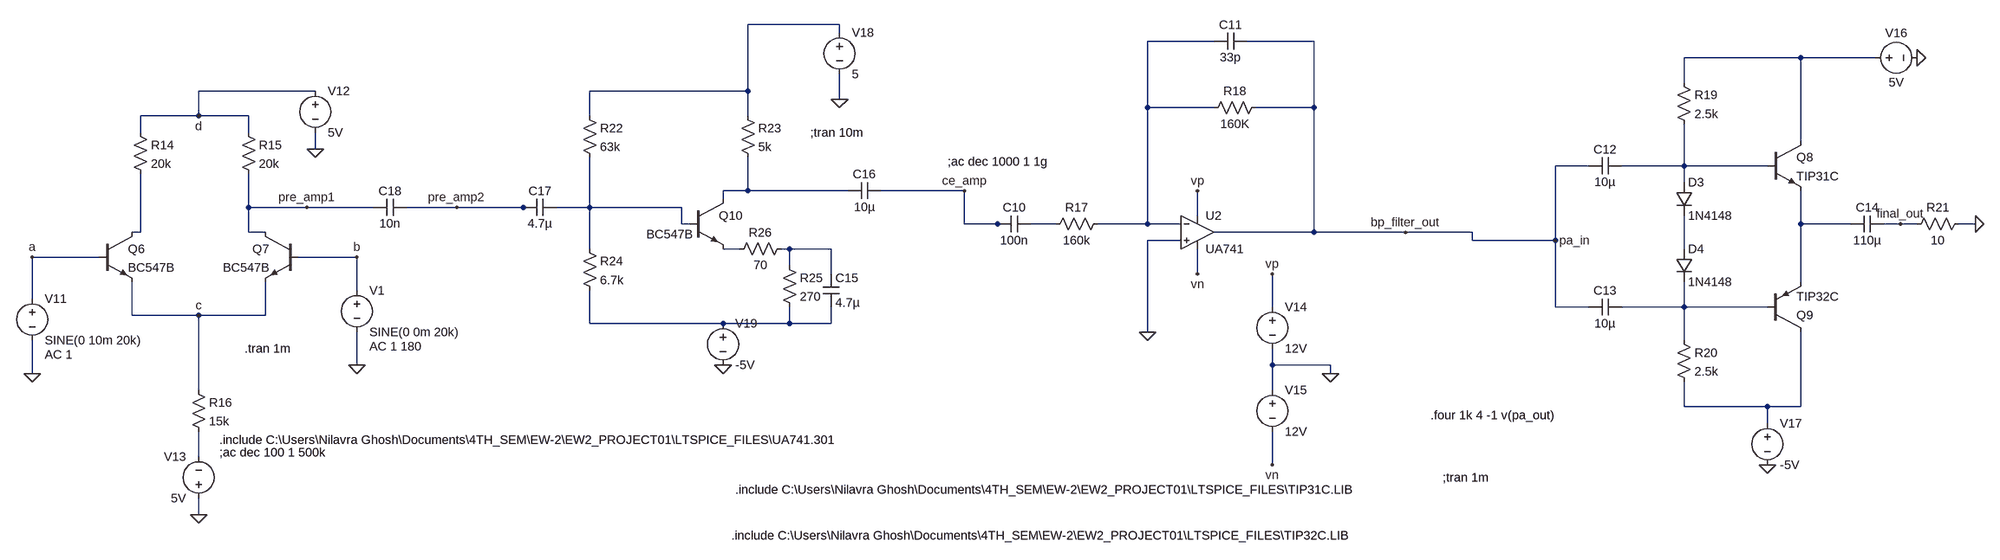
[diagram p0: schematic check_combined.asc]
check_combined.asc, the LTspice schematic file:
Version 4
SHEET 1 4244 2864
WIRE 1504 1440 1328 1440
WIRE 1504 1456 1504 1440
WIRE 2224 1472 2096 1472
WIRE 2416 1472 2288 1472
WIRE 3360 1504 3136 1504
WIRE 3504 1504 3360 1504
WIRE 3136 1552 3136 1504
WIRE 496 1568 272 1568
WIRE 1328 1568 1328 1440
WIRE 1328 1568 1024 1568
WIRE 1504 1584 1504 1536
WIRE 2096 1600 2096 1472
WIRE 2224 1600 2096 1600
WIRE 2416 1600 2416 1472
WIRE 2416 1600 2304 1600
WIRE 272 1616 272 1568
WIRE 272 1616 160 1616
WIRE 368 1616 272 1616
WIRE 1024 1616 1024 1568
WIRE 1328 1616 1328 1568
WIRE 160 1648 160 1616
WIRE 368 1648 368 1616
WIRE 3360 1664 3360 1504
WIRE 496 1680 496 1648
WIRE 2944 1712 2880 1712
WIRE 3136 1712 3136 1632
WIRE 3136 1712 3008 1712
WIRE 3296 1712 3136 1712
WIRE 3136 1744 3136 1712
WIRE 1328 1760 1328 1696
WIRE 1328 1760 1280 1760
WIRE 1520 1760 1328 1760
WIRE 1744 1760 1584 1760
WIRE 1280 1776 1280 1760
WIRE 368 1792 368 1728
WIRE 480 1792 368 1792
WIRE 608 1792 480 1792
WIRE 768 1792 672 1792
WIRE 896 1792 768 1792
WIRE 912 1792 896 1792
WIRE 1024 1792 1024 1696
WIRE 1024 1792 960 1792
WIRE 1200 1792 1024 1792
WIRE 2192 1808 2192 1760
WIRE 1200 1824 1200 1792
WIRE 1216 1824 1200 1824
WIRE 1744 1824 1744 1760
WIRE 1808 1824 1744 1824
WIRE 1824 1824 1808 1824
WIRE 1920 1824 1872 1824
WIRE 2096 1824 2096 1600
WIRE 2096 1824 2000 1824
WIRE 2160 1824 2096 1824
WIRE 3360 1824 3360 1760
WIRE 3456 1824 3360 1824
WIRE 3552 1824 3520 1824
WIRE 3584 1824 3552 1824
WIRE 3696 1824 3664 1824
WIRE 160 1840 160 1728
WIRE 160 1840 144 1840
WIRE 368 1840 368 1792
WIRE 400 1840 368 1840
WIRE 2416 1840 2416 1600
WIRE 2416 1840 2224 1840
WIRE 2592 1840 2416 1840
WIRE 2720 1840 2592 1840
WIRE 2160 1856 2096 1856
WIRE 2720 1856 2720 1840
WIRE 2880 1856 2880 1712
WIRE 2880 1856 2720 1856
WIRE 1024 1872 1024 1792
WIRE 1312 1872 1280 1872
WIRE 1408 1872 1392 1872
WIRE 1488 1872 1408 1872
WIRE 3136 1872 3136 1808
WIRE 80 1888 -48 1888
WIRE 576 1888 464 1888
WIRE 1408 1904 1408 1872
WIRE 1488 1920 1488 1872
WIRE 2192 1920 2192 1872
WIRE 3360 1936 3360 1824
WIRE 576 1952 576 1888
WIRE -48 1968 -48 1888
WIRE 2336 1984 2336 1920
WIRE 2880 1984 2880 1856
WIRE 2944 1984 2880 1984
WIRE 3136 1984 3136 1936
WIRE 3136 1984 3008 1984
WIRE 3296 1984 3136 1984
WIRE 144 2000 144 1936
WIRE 272 2000 144 2000
WIRE 400 2000 400 1936
WIRE 400 2000 272 2000
WIRE 1024 2016 1024 1952
WIRE 1280 2016 1024 2016
WIRE 1408 2016 1408 1984
WIRE 1408 2016 1280 2016
WIRE 1488 2016 1488 1984
WIRE 1488 2016 1408 2016
WIRE 2096 2032 2096 1856
WIRE 3136 2048 3136 1984
WIRE 576 2096 576 2032
WIRE 2336 2096 2336 2064
WIRE 2448 2096 2336 2096
WIRE -48 2112 -48 2048
WIRE 2448 2112 2448 2096
WIRE 272 2144 272 2000
WIRE 2336 2144 2336 2096
WIRE 3136 2176 3136 2128
WIRE 3296 2176 3136 2176
WIRE 3360 2176 3360 2032
WIRE 3360 2176 3296 2176
WIRE 3296 2208 3296 2176
WIRE 272 2272 272 2224
WIRE 2336 2288 2336 2224
WIRE 272 2384 272 2352
FLAG -48 2112 0
FLAG 496 1680 0
FLAG 272 2384 0
FLAG -48 1888 a
FLAG 576 1888 b
FLAG 272 2000 c
FLAG 272 1616 d
FLAG 2448 2112 0
FLAG 2336 1920 vp
FLAG 2336 2288 vn
FLAG 2192 1760 vp
FLAG 2192 1920 vn
FLAG 2096 2032 0
FLAG 3696 1824 0
FLAG 3584 1504 0
FLAG 3296 2288 0
FLAG 2880 1856 pa_in
FLAG 3552 1824 final_out
FLAG 1504 1584 0
FLAG 1280 2096 0
FLAG 576 2096 0
FLAG 768 1792 pre_amp2
FLAG 480 1792 pre_amp1
FLAG 1744 1760 ce_amp
FLAG 2592 1840 bp_filter_out
SYMBOL voltage -48 1952 R0
WINDOW 123 24 124 Left 2
WINDOW 39 0 0 Left 0
SYMATTR Value2 AC 1
SYMATTR InstName V11
SYMATTR Value SINE(0 10m 20k)
SYMBOL res 144 1632 R0
SYMATTR InstName R14
SYMATTR Value 20k
SYMBOL res 352 1632 R0
SYMATTR InstName R15
SYMATTR Value 20k
SYMBOL res 256 2128 R0
SYMATTR InstName R16
SYMATTR Value 15k
SYMBOL npn 80 1840 R0
SYMATTR InstName Q6
SYMATTR Value BC547B
SYMBOL npn 464 1840 M0
SYMATTR InstName Q7
SYMATTR Value BC547B
SYMBOL voltage 496 1552 R0
WINDOW 123 0 0 Left 0
WINDOW 39 0 0 Left 0
SYMATTR InstName V12
SYMATTR Value 5V
SYMBOL voltage 272 2368 R180
WINDOW 0 24 96 Left 2
WINDOW 3 24 16 Left 2
WINDOW 123 0 0 Left 0
WINDOW 39 0 0 Left 0
SYMATTR InstName V13
SYMATTR Value 5V
SYMBOL OpAmps\\opamp2 2192 1776 R0
SYMATTR InstName U2
SYMATTR Value UA741
SYMBOL voltage 2336 1968 R0
WINDOW 123 0 0 Left 0
WINDOW 39 0 0 Left 0
SYMATTR InstName V14
SYMATTR Value 12V
SYMBOL voltage 2336 2128 R0
WINDOW 123 0 0 Left 0
WINDOW 39 0 0 Left 0
SYMATTR InstName V15
SYMATTR Value 12V
SYMBOL res 2016 1808 R90
WINDOW 0 0 56 VBottom 2
WINDOW 3 32 56 VTop 2
SYMATTR InstName R17
SYMATTR Value 160k
SYMBOL cap 1872 1808 R90
WINDOW 0 0 32 VBottom 2
WINDOW 3 32 32 VTop 2
SYMATTR InstName C10
SYMATTR Value 100n
SYMBOL res 2320 1584 R90
WINDOW 0 0 56 VBottom 2
WINDOW 3 32 56 VTop 2
SYMATTR InstName R18
SYMATTR Value 160K
SYMBOL cap 2288 1456 R90
WINDOW 0 0 32 VBottom 2
WINDOW 3 32 32 VTop 2
SYMATTR InstName C11
SYMATTR Value 33p
SYMBOL cap 3008 1696 R90
WINDOW 0 0 32 VBottom 2
WINDOW 3 32 32 VTop 2
SYMATTR InstName C12
SYMATTR Value 10µ
SYMBOL cap 3008 1968 R90
WINDOW 0 0 32 VBottom 2
WINDOW 3 32 32 VTop 2
SYMATTR InstName C13
SYMATTR Value 10µ
SYMBOL res 3120 1536 R0
SYMATTR InstName R19
SYMATTR Value 2.5k
SYMBOL res 3120 2032 R0
SYMATTR InstName R20
SYMATTR Value 2.5k
SYMBOL npn 3296 1664 R0
SYMATTR InstName Q8
SYMATTR Value TIP31C
SYMBOL pnp 3296 2032 M180
SYMATTR InstName Q9
SYMATTR Value TIP32C
SYMBOL diode 3120 1744 R0
SYMATTR InstName D3
SYMATTR Value 1N4148
SYMBOL diode 3120 1872 R0
SYMATTR InstName D4
SYMATTR Value 1N4148
SYMBOL voltage 3488 1504 R270
WINDOW 0 32 56 VTop 2
WINDOW 3 -32 56 VBottom 2
WINDOW 123 0 0 Left 0
WINDOW 39 0 0 Left 0
SYMATTR InstName V16
SYMATTR Value 5V
SYMBOL res 3680 1808 R90
WINDOW 0 0 56 VBottom 2
WINDOW 3 32 56 VTop 2
SYMATTR InstName R21
SYMATTR Value 10
SYMBOL voltage 3296 2192 R0
WINDOW 123 0 0 Left 0
WINDOW 39 0 0 Left 0
SYMATTR InstName V17
SYMATTR Value -5V
SYMBOL cap 3520 1808 R90
WINDOW 0 0 32 VBottom 2
WINDOW 3 32 32 VTop 2
SYMATTR InstName C14
SYMATTR Value 110µ
SYMBOL res 1008 1600 R0
SYMATTR InstName R22
SYMATTR Value 63k
SYMBOL res 1312 1600 R0
SYMATTR InstName R23
SYMATTR Value 5k
SYMBOL cap 1472 1920 R0
SYMATTR InstName C15
SYMATTR Value 4.7µ
SYMBOL res 1008 1856 R0
SYMATTR InstName R24
SYMATTR Value 6.7k
SYMBOL npn 1216 1776 R0
WINDOW 3 -83 68 Left 2
SYMATTR Value BC547B
SYMATTR InstName Q10
SYMBOL res 1392 1888 R0
SYMATTR InstName R25
SYMATTR Value 270
SYMBOL res 1408 1856 R90
WINDOW 0 0 56 VBottom 2
WINDOW 3 32 56 VTop 2
SYMATTR InstName R26
SYMATTR Value 70
SYMBOL voltage 1504 1440 R0
WINDOW 123 0 0 Left 0
WINDOW 39 0 0 Left 0
SYMATTR InstName V18
SYMATTR Value 5
SYMBOL cap 1584 1744 R90
WINDOW 0 0 32 VBottom 2
WINDOW 3 32 32 VTop 2
SYMATTR InstName C16
SYMATTR Value 10µ
SYMBOL cap 960 1776 R90
WINDOW 0 0 32 VBottom 2
WINDOW 3 32 32 VTop 2
SYMATTR InstName C17
SYMATTR Value 4.7µ
SYMBOL voltage 1280 2000 R0
WINDOW 123 0 0 Left 0
WINDOW 39 0 0 Left 0
SYMATTR InstName V19
SYMATTR Value -5V
SYMBOL cap 672 1776 R90
WINDOW 0 0 32 VBottom 2
WINDOW 3 32 32 VTop 2
SYMATTR InstName C18
SYMATTR Value 10n
SYMBOL voltage 576 1936 R0
WINDOW 123 24 124 Left 2
WINDOW 39 0 0 Left 0
SYMATTR Value2 AC 1 180
SYMATTR InstName V1
SYMATTR Value SINE(0 0m 20k)
TEXT 360 2064 Left 2 !.tran 1m
TEXT 2664 2312 Left 2 !;tran 1m
TEXT 1448 1648 Left 2 !;tran 10m
TEXT 1712 1704 Left 2 !;ac dec 1000 1 1g
TEXT 2640 2192 Left 2 !.four 1k 4 -1 v(pa_out)
TEXT 312 2240 Left 2 !.include C:\\Users\\Nilavra Ghosh\\Documents\\4TH_SEM\\EW-2\\EW2_PROJECT01\\LTSPICE_FILES\\UA741.301
TEXT 312 2264 Left 2 !;ac dec 100 1 500k
TEXT 1304 2336 Left 2 !.include C:\\Users\\Nilavra Ghosh\\Documents\\4TH_SEM\\EW-2\\EW2_PROJECT01\\LTSPICE_FILES\\TIP31C.LIB
TEXT 1296 2424 Left 2 !.include C:\\Users\\Nilavra Ghosh\\Documents\\4TH_SEM\\EW-2\\EW2_PROJECT01\\LTSPICE_FILES\\TIP32C.LIB

The netlist it stands for:
* check_combined.asc
V11 a 0 SINE(0 10m 20k) AC 1
R14 d N009 20k
R15 d pre_amp1 20k
R16 c N016 15k
Q6 N009 a c 0 BC547B
Q7 pre_amp1 b c 0 BC547B
V12 d 0 5V
V13 0 N016 5V
XU2 0 N002 vp vn bp_filter_out UA741  ; pins In+ In- V+ V- OUT
V14 vp 0 12V
V15 0 vn 12V
R17 N002 N007 160k
C10 N007 ce_amp 100n
R18 bp_filter_out N002 160K
C11 bp_filter_out N002 33p
C12 N004 bp_filter_out 10µ
C13 N013 bp_filter_out 10µ
R19 N003 N004 2.5k
R20 N013 N015 2.5k
Q8 N003 N004 N008 0 TIP31C
Q9 N015 N013 N008 0 TIP32C
D3 N004 N012 1N4148
D4 N012 N013 1N4148
V16 N003 0 5V
R21 0 final_out 10
V17 N015 0 -5V
C14 final_out N008 110µ
R22 N001 N006 63k
R23 N001 N005 5k
C15 N011 N014 4.7µ
R24 N006 N014 6.7k
Q10 N005 N006 N010 0 BC547B
R25 N011 N014 270
R26 N011 N010 70
V18 N001 0 5
C16 ce_amp N005 10µ
C17 N006 pre_amp2 4.7µ
V19 N014 0 -5V
C18 pre_amp2 pre_amp1 10n
V1 b 0 SINE(0 0m 20k) AC 1 180
.model D D
.lib standard.dio
.model NPN NPN
.model PNP PNP
.lib standard.bjt
.tran 1m
;tran 1m
;tran 10m
;ac dec 1000 1 1g
.four 1k 4 -1 v(pa_out)
.include C:\Users\Nilavra Ghosh\Documents\4TH_SEM\EW-2\EW2_PROJECT01\LTSPICE_FILES\UA741.301
;ac dec 100 1 500k
.include C:\Users\Nilavra Ghosh\Documents\4TH_SEM\EW-2\EW2_PROJECT01\LTSPICE_FILES\TIP31C.LIB
.include C:\Users\Nilavra Ghosh\Documents\4TH_SEM\EW-2\EW2_PROJECT01\LTSPICE_FILES\TIP32C.LIB
.backanno
.end